# Altium schematic sheet Charger.SchDoc
size A4; SheetNumber: 12; SheetTotal: 21
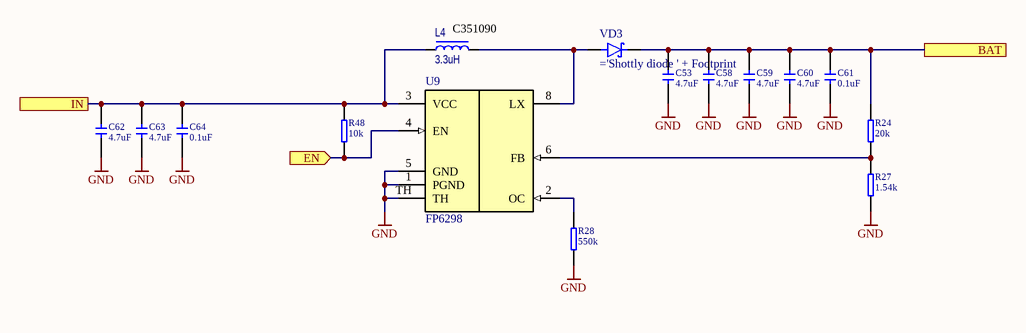
[diagram p0: Charger.SchDoc]

## Parts
C53  value 4.7uF  [CERCAP 0603]
C58  value 4.7uF  [CERCAP 0603]
C59  value 4.7uF  [CERCAP 0603]
C60  value 4.7uF  [CERCAP 0603]
C61  value 0.1uF  [CERCAP 0402]
C62  value 4.7uF  [CERCAP 0603]
C63  value 4.7uF  [CERCAP 0603]
C64  value 0.1uF  [CERCAP 0402]
L4  value 3.3uH  [IND-4.6x4.6]
R24  value 20k  [RES 0402]
R27  value 1.54k  [RES 0402]
R28  value 550k  [RES 0402]
R48  value 10k  [RES 0402]
U9  FP6298  [SO-8(EP)]
VD3  (no value)  [SOD-123]

## Ports
BAT, EN (in), IN

## Nets
GND: C53.1 C58.1 C59.1 C60.1 C61.1 C62.1 C63.1 C64.1 R27.1 R28.1 U9.1(PGND) U9.5(GND) U9.TH
BAT: C53.2 C58.2 C59.2 C60.2 C61.2 R24.2 VD3.C(Cathode) ; port BAT
EN: R48.1 U9.4(EN) ; port EN
IN: C62.2 C63.2 C64.2 L4.1 R48.2 U9.3(VCC) ; port IN
NetL4_2: L4.2 U9.8(LX) VD3.A(Anode)
NetR24_1: R24.1 R27.2 U9.6(FB)
NetR28_2: R28.2 U9.2(OC)

## Notes on the sheet
- (near L4) C351090

## Library data of the parts
C53 C58-C60 = !Capacitor: Capacitor; IsSMT: NoSMT; Voltage: 16V; Diel: X7R
C61 C64 = !Capacitor: Capacitor; IsSMT: NoSMT; Voltage: 50V; Diel: X7R
C62 C63 = !Capacitor: Capacitor; IsSMT: NoSMT; Voltage: 10V; Diel: X7R
L4 = Inductor: IsSMT: NoSMT
R24 R27 R28 R48 = !Resistor: Resistor; IsSMT: NoSMT
U9 = FP6298: boost not-synq wEN woPG wCL
VD3 = DiodeS: Diode Shottky; IsSMT: NoSMT